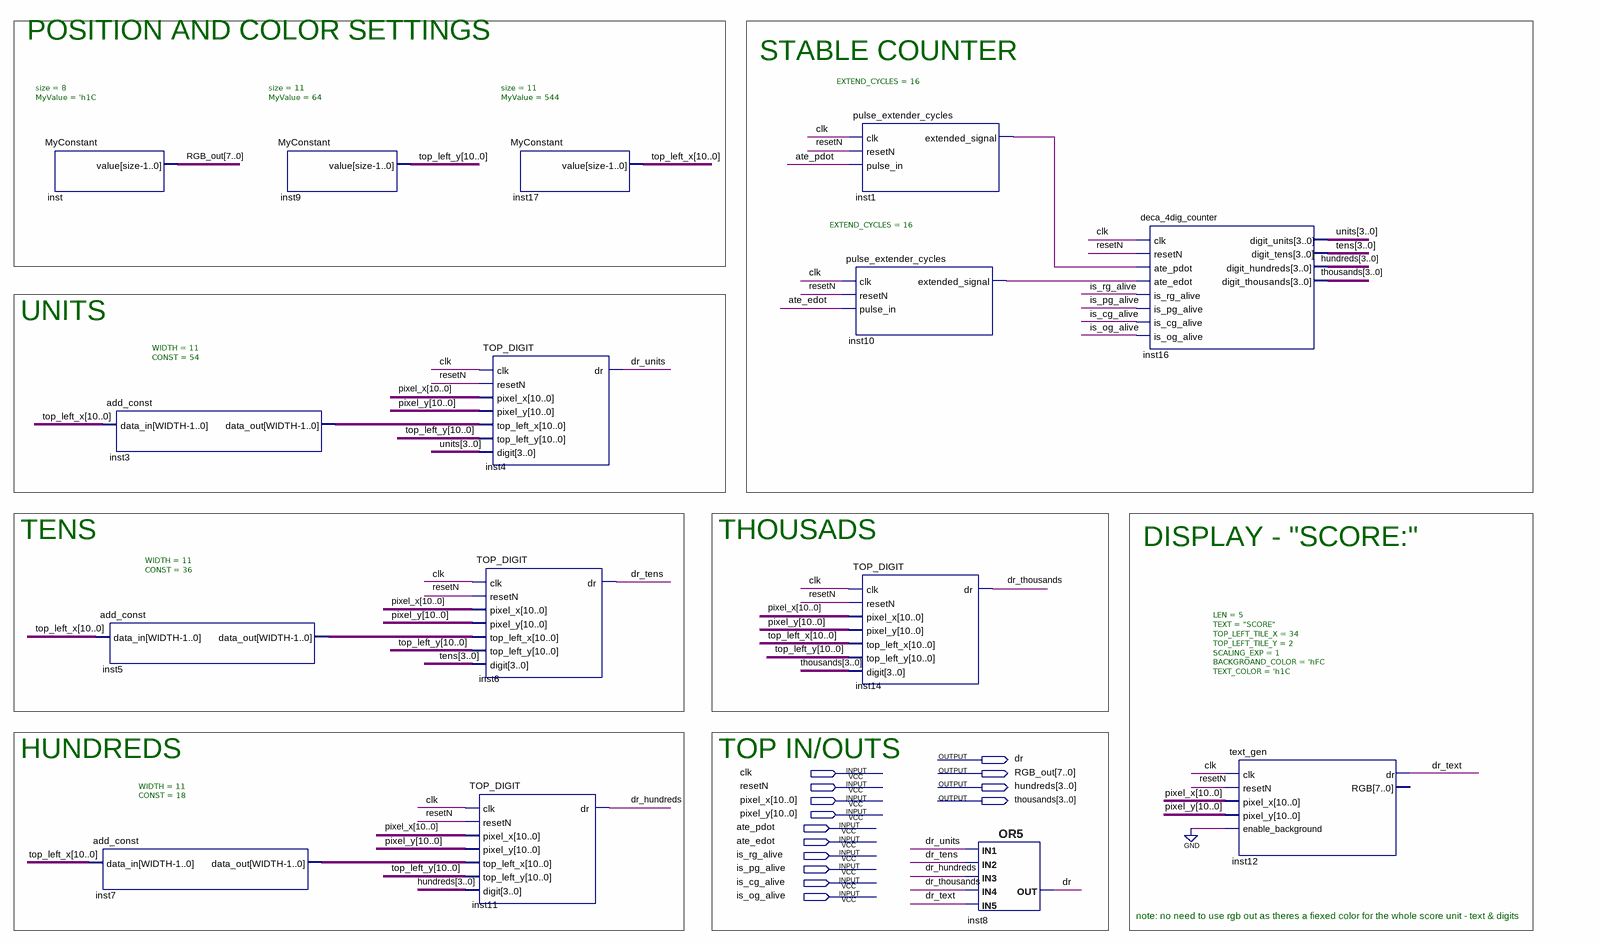
[diagram p0: schematic sheet]
// Quartus schematic TOP_SCORE_BOARD.bdf as structural Verilog: 15 symbols, 14 pins
module TOP_SCORE_BOARD (
  input  clk,
  input  resetN,
  input  [10:0] pixel_x,
  input  [10:0] pixel_y,
  input  ate_pdot,
  input  ate_edot,
  input  is_rg_alive,
  input  is_pg_alive,
  input  is_cg_alive,
  input  is_og_alive,
  output dr,
  output [7:0] RGB_out,
  output [3:0] hundreds,
  output [3:0] thousands
);

  wire dr_hundreds, dr_tens, dr_text, dr_thousands, dr_units, inst1_extended_signal, inst10_extended_signal;
  wire [3:0] tens, units;
  wire [10:0] inst3_data_out, inst5_data_out, inst7_data_out, top_left_x, top_left_y;

  MyConstant #(.size(8), .MyValue('h1C)) inst (.value(RGB_out));
  add_const #(.WIDTH(11), .CONST(54)) inst3 (.data_in(top_left_x), .data_out(inst3_data_out));
  add_const #(.WIDTH(11), .CONST(36)) inst5 (.data_in(top_left_x), .data_out(inst5_data_out));
  add_const #(.WIDTH(11), .CONST(18)) inst7 (.data_in(top_left_x), .data_out(inst7_data_out));
  MyConstant #(.size(11), .MyValue(64)) inst9 (.value(top_left_y));
  MyConstant #(.size(11), .MyValue(544)) inst17 (.value(top_left_x));
  TOP_DIGIT inst4 (
    .clk(clk), .resetN(resetN), .pixel_x(pixel_x), .pixel_y(pixel_y), .top_left_x(inst3_data_out),
    .top_left_y(top_left_y), .digit(units), .dr(dr_units));
  TOP_DIGIT inst6 (
    .clk(clk), .resetN(resetN), .pixel_x(pixel_x), .pixel_y(pixel_y), .top_left_x(inst5_data_out),
    .top_left_y(top_left_y), .digit(tens), .dr(dr_tens));
  TOP_DIGIT inst11 (
    .clk(clk), .resetN(resetN), .pixel_x(pixel_x), .pixel_y(pixel_y), .top_left_x(inst7_data_out),
    .top_left_y(top_left_y), .digit(hundreds), .dr(dr_hundreds));
  pulse_extender_cycles #(.EXTEND_CYCLES(16)) inst10 (
    .clk(clk), .resetN(resetN), .pulse_in(ate_edot), .extended_signal(inst10_extended_signal));
  pulse_extender_cycles #(.EXTEND_CYCLES(16)) inst1 (
    .clk(clk), .resetN(resetN), .pulse_in(ate_pdot), .extended_signal(inst1_extended_signal));
  TOP_DIGIT inst14 (
    .clk(clk), .resetN(resetN), .pixel_x(pixel_x), .pixel_y(pixel_y), .top_left_x(top_left_x),
    .top_left_y(top_left_y), .digit(thousands), .dr(dr_thousands));
  or inst8 (dr, dr_units, dr_tens, dr_hundreds, dr_thousands, dr_text);
  deca_4dig_counter inst16 (
    .clk(clk), .resetN(resetN), .ate_pdot(inst1_extended_signal), .ate_edot(inst10_extended_signal),
    .is_rg_alive(is_rg_alive), .is_pg_alive(is_pg_alive), .is_cg_alive(is_cg_alive),
    .is_og_alive(is_og_alive), .digit_units(units), .digit_tens(tens), .digit_hundreds(hundreds),
    .digit_thousands(thousands));
  text_gen #(.LEN(5), .TEXT("SCORE"), .TOP_LEFT_TILE_X(34), .TOP_LEFT_TILE_Y(2), .SCALING_EXP(1), .BACKGROAND_COLOR('hFC), .TEXT_COLOR('h1C)) inst12 (
    .clk(clk), .resetN(resetN), .pixel_x(pixel_x), .pixel_y(pixel_y), .enable_background(1'b0), .dr(dr_text));  // open: RGB

  // Notes on the sheet:
  //   POSITION AND COLOR SETTINGS
  //   STABLE COUNTER
  //   UNITS
  //   TENS
  //   THOUSADS
  //   DISPLAY - "SCORE:"
  //   HUNDREDS
  //   TOP IN/OUTS
  //   note: no need to use rgb out as theres a fiexed color for the whole score unit - text & digits
endmodule
